# EAGLE design NLQHD-SATA Front Panel Rev1 (EAGLE 9.7.0)
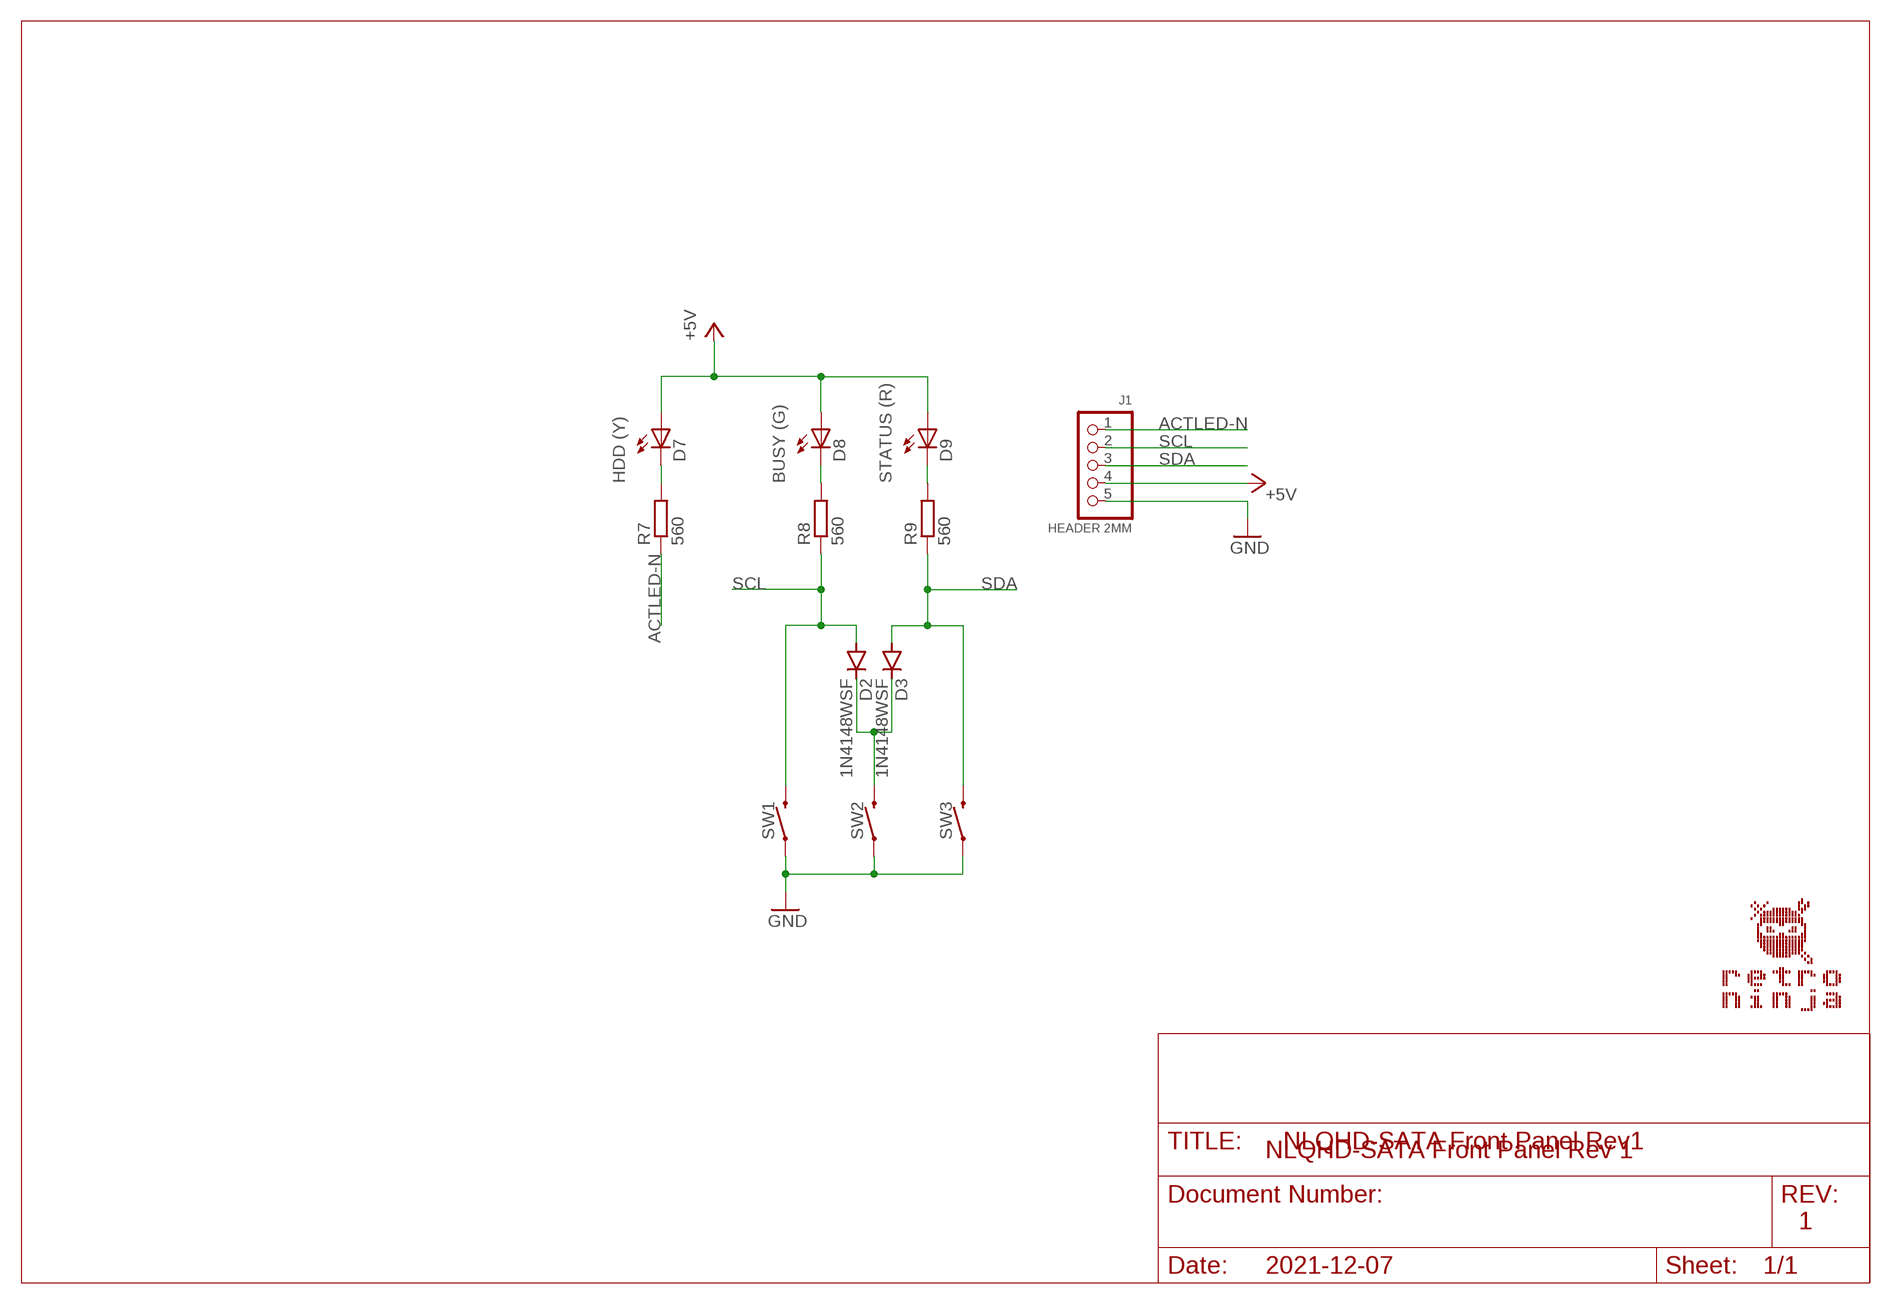
[diagram p0: schematic, sheet 1]

## Parts
D2  1N4148WSF  DIODE_SOD-323F  [SOD-323F]
D3  1N4148WSF  DIODE_SOD-323F  [SOD-323F]
D7  LED_3MM_RED  [LED3MM_RED]
D8  LED_3MM_GREEN  [LED3MM_GREEN]
D9  LED_3MM_GREEN  [LED3MM_GREEN]
J1  HEADER 2MM  HEADER_1X5_2MM_JST  [HEADER_1X5_2MM_JST]
R7  560  R-EU_R0805  [R0805]
R8  560  R-EU_R0805  [R0805]
R9  560  R-EU_R0805  [R0805]
SW1  SWITCH_MOMENTARY_6.0X5.0  [SWITCH_MOM_6.0MMX5.0MM]
SW2  SWITCH_MOMENTARY_6.0X5.0  [SWITCH_MOM_6.0MMX5.0MM]
SW3  SWITCH_MOMENTARY_6.0X5.0  [SWITCH_MOM_6.0MMX5.0MM]

## Nets
+5V: D7.A D8.A D9.A J1.4
ACTLED-N: J1.1 R7.1
ACTLED-RES: D7.K(C) R7.2
BUSYLED-RES: D8.K(C) R8.2
GND: J1.5 SW1.1 SW1.2 SW2.1 SW2.2 SW3.1 SW3.2
N$13: D2.C D3.C SW2.3 SW2.4
SCL: D2.A J1.2 R8.1 SW1.3 SW1.4
SDA: D3.A J1.3 R9.1 SW3.3 SW3.4
STATLED-RES: D9.K(C) R9.2

## Notes on the sheet
- HDD (Y) | BUSY (G) | STATUS (R)
- NLQHD-SATA Front Panel Rev 1
- 1
- 2021-12-07

## Library data of the parts
D2 D3 = Per (Fusion 360):DIODE
D7-D9 = Per (Fusion 360):LED
J1 = Per (Fusion 360):HEADER_1X5
R7-R9 = rcl:R-EU_: RESISTOR, European symbol; SPICEPREFIX: R
SW1-SW3 = Per (Fusion 360):SWITCH_MOMENTARY

## Board
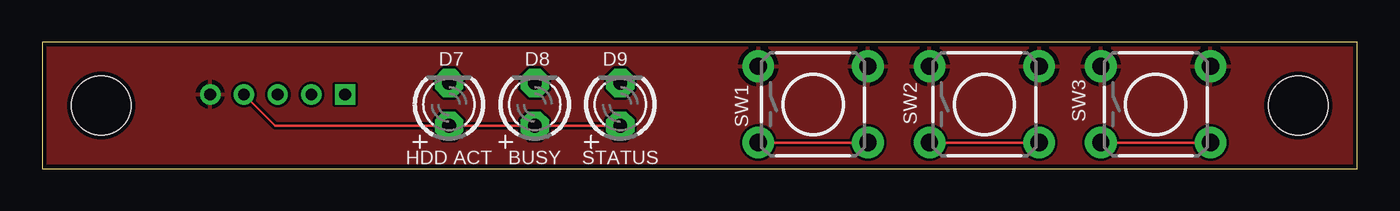
[diagram p1: board, top side]
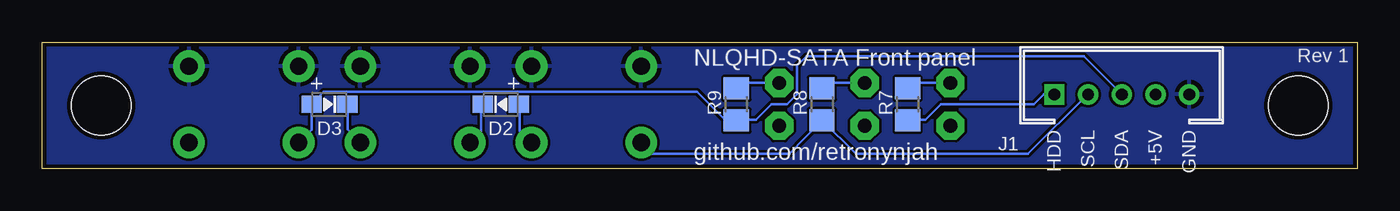
[diagram p2: board, bottom side, seen from below]

Size 78 x 7.5 mm. Coordinates in mm from the lower left corner, seen from the top.
Outline: 0,0 78,0 78,7.5 0,7.5 0,0
Copper layers (1*16): Top 0.035mm / dielectric 1.5mm / Bottom 0.035mm
Design rules "SeeedStudio_2layer_DRU_no_angle_20140221": minimum track width 6mil, minimum drill 12mil, track to track 6mil, track to pad 6mil, pad to pad 6mil, via to via 6mil, smd to smd 0mil, copper to edge 10mil, drill to drill 10mil, minimum pad ring 10mil, minimum via ring 6mil, stop-mask expansion 2mil, vias tented up to drill 100mil, thermal gap 10mil
Holes 3.5 mm at 3.5,3.75 74.5,3.75

### Footprints (pad centres in the part's own frame; a part is rotated, then mirrored left to right if it is on the bottom)
SOD-323F = smd 1.2 x 1: A 1.065,0; C -1.065,0
LED3MM_RED = drill 0.813 pad 1.676 octagon: A -1.27,0; K 1.27,0
LED3MM_GREEN = drill 0.813 pad 1.676 octagon: A -1.27,0; K 1.27,0
HEADER_1X5_2MM_JST = drill 0.7 square: 1 -4,0 | drill 0.7: 2 -2,0; 3 0,0; 4 2,0; 5 4,0
R0805 = smd 1.3 x 1.5: 1 -0.95,0; 2 0.95,0
SWITCH_MOM_6.0MMX5.0MM = drill 1.016 pad 1.88: 1 -3.251,2.261; 2 3.251,2.261; 3 -3.251,-2.261; 4 3.251,-2.261

### Placement (x,y rotation side)
D2  50.8,3.81 0 bottom
D3  60.96,3.81 180 bottom
D7  24.13,3.81 90 top
D8  29.21,3.81 90 top
D9  34.29,3.81 90 top
J1  13.97,4.4 0 bottom
R7  26.67,3.81 90 bottom
R8  31.75,3.81 90 bottom
R9  36.83,3.81 90 bottom
SW1  45.72,3.81 0 top
SW2  55.88,3.81 0 top
SW3  66.04,3.81 0 top

### Tracks (layer width: path | path; a pad name or v marks a point on that pad's centre or on a via)
+5V
  Top 0.152: J1.4 11.97,4.39 13.82,2.54 D7.A D8.A D9.A
ACTLED-N
  Bottom 0.152: J1.1 18.59,4.4 19.18,3.81 24.69,3.81 25.6,2.9 26.67,2.9 R7.1
ACTLED-RES
  Bottom 0.152: D7.K 26.29,5.08 26.64,4.72 26.67,4.72 R7.2
BUSYLED-RES
  Bottom 0.152: D8.K 31.37,5.08 31.71,4.74 R8.2
GND
  pour Bottom: 0.08,0.08 77.92,0.08 77.92,7.42 0.08,7.42
  pour Top: 0.08,0.08 77.92,0.08 77.92,7.42 0.08,7.42
N$13
  Top 0.152: SW2.3 SW2.4
  Bottom 0.152: D2.C 51.97,3.81 51.97,2.21 SW2.3 | SW2.4 59.13,1.57 59.89,2.34 D3.C
SCL
  Top 0.152: SW1.3 SW1.4
  Bottom 0.152: D2.A 49.68,3.81 49.68,2.26 SW1.4 | R8.1 31.85,2.74 32,2.74 R8.1 | J1.2 19.53,0.89 29.73,0.89 R8.1 | R8.1 33.67,0.89 41.86,0.89 SW1.3
SDA
  Top 0.152: SW3.3 SW3.4
  Bottom 0.152: J1.3 16.23,6.66 32.66,6.66 33.22,6.1 33.22,4.42 33.83,3.81 34.75,3.81 35.66,2.9 36.73,2.9 R9.1 36.88,2.9 37.49,2.9 39.17,4.57 61.32,4.57 62.02,3.86 D3.A 62.03,2.31 SW3.3
STATLED-RES
  Bottom 0.152: D9.K 36.45,5.08 36.78,4.74 R9.2

### Text on the board
tPlace: HDD ACT | BUSY | STATUS
bPlace: Rev 1 | NLQHD-SATA Front panel | + | + | GND | +5V | SDA | SCL | HDD | github.com/retronynjah